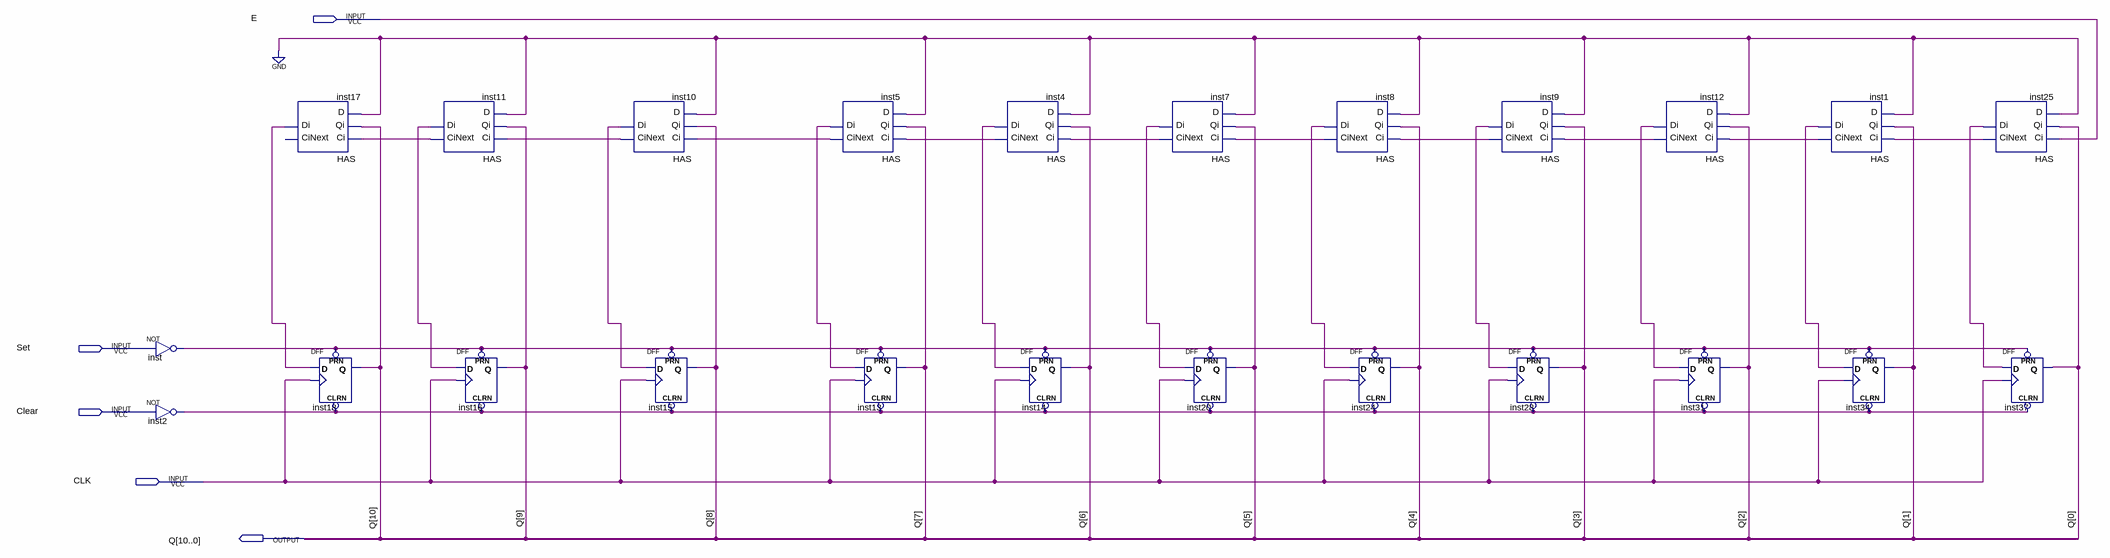
[diagram p0: schematic sheet]
// Quartus schematic Queue_Counter.bdf as structural Verilog: 24 symbols, 5 pins
module Queue_Counter (
  input  E,
  input  Set,
  input  Clear,
  input  CLK,
  output [10:0] Q
);

  wire inst1_cinext, inst1_di, inst2_out, inst4_cinext, inst4_di, inst5_cinext, inst5_di, inst7_cinext,
       inst7_di, inst8_cinext, inst8_di, inst9_cinext, inst9_di, inst10_cinext, inst10_di, inst11_cinext,
       inst11_di, inst12_cinext, inst12_di, inst17_di, inst25_cinext, inst25_di, inst_out;

  not inst (inst_out, Set);
  not inst2 (inst2_out, Clear);
  HAS inst17 (.Ci(inst11_cinext), .Qi(Q[10]), .D(1'b0), .Di(inst17_di));  // open: CiNext
  DFF inst18 (.CLRN(inst2_out), .CLK(CLK), .D(inst17_di), .PRN(inst_out), .Q(Q[10]));
  HAS inst11 (.Ci(inst10_cinext), .Qi(Q[9]), .D(1'b0), .CiNext(inst11_cinext), .Di(inst11_di));
  DFF inst16 (.CLRN(inst2_out), .CLK(CLK), .D(inst11_di), .PRN(inst_out), .Q(Q[9]));
  HAS inst10 (.Ci(inst5_cinext), .Qi(Q[8]), .D(1'b0), .CiNext(inst10_cinext), .Di(inst10_di));
  DFF inst15 (.CLRN(inst2_out), .CLK(CLK), .D(inst10_di), .PRN(inst_out), .Q(Q[8]));
  HAS inst5 (.Ci(inst4_cinext), .Qi(Q[7]), .D(1'b0), .CiNext(inst5_cinext), .Di(inst5_di));
  DFF inst13 (.CLRN(inst2_out), .CLK(CLK), .D(inst5_di), .PRN(inst_out), .Q(Q[7]));
  HAS inst4 (.Ci(inst7_cinext), .Qi(Q[6]), .D(1'b0), .CiNext(inst4_cinext), .Di(inst4_di));
  DFF inst14 (.CLRN(inst2_out), .CLK(CLK), .D(inst4_di), .PRN(inst_out), .Q(Q[6]));
  HAS inst7 (.Ci(inst8_cinext), .Qi(Q[5]), .D(1'b0), .CiNext(inst7_cinext), .Di(inst7_di));
  DFF inst20 (.CLRN(inst2_out), .CLK(CLK), .D(inst7_di), .PRN(inst_out), .Q(Q[5]));
  HAS inst8 (.Ci(inst9_cinext), .Qi(Q[4]), .D(1'b0), .CiNext(inst8_cinext), .Di(inst8_di));
  DFF inst24 (.CLRN(inst2_out), .CLK(CLK), .D(inst8_di), .PRN(inst_out), .Q(Q[4]));
  HAS inst9 (.Ci(inst12_cinext), .Qi(Q[3]), .D(1'b0), .CiNext(inst9_cinext), .Di(inst9_di));
  DFF inst28 (.CLRN(inst2_out), .CLK(CLK), .D(inst9_di), .PRN(inst_out), .Q(Q[3]));
  HAS inst12 (.Ci(inst1_cinext), .Qi(Q[2]), .D(1'b0), .CiNext(inst12_cinext), .Di(inst12_di));
  DFF inst31 (.CLRN(inst2_out), .CLK(CLK), .D(inst12_di), .PRN(inst_out), .Q(Q[2]));
  HAS inst1 (.Ci(inst25_cinext), .Qi(Q[1]), .D(1'b0), .CiNext(inst1_cinext), .Di(inst1_di));
  DFF inst34 (.CLRN(inst2_out), .CLK(CLK), .D(inst1_di), .PRN(inst_out), .Q(Q[1]));
  HAS inst25 (.Ci(E), .Qi(Q[0]), .D(1'b0), .CiNext(inst25_cinext), .Di(inst25_di));
  DFF inst37 (.CLRN(inst2_out), .CLK(CLK), .D(inst25_di), .PRN(inst_out), .Q(Q[0]));
endmodule
